# EAGLE design memoryboard31 (EAGLE 7.3.0)
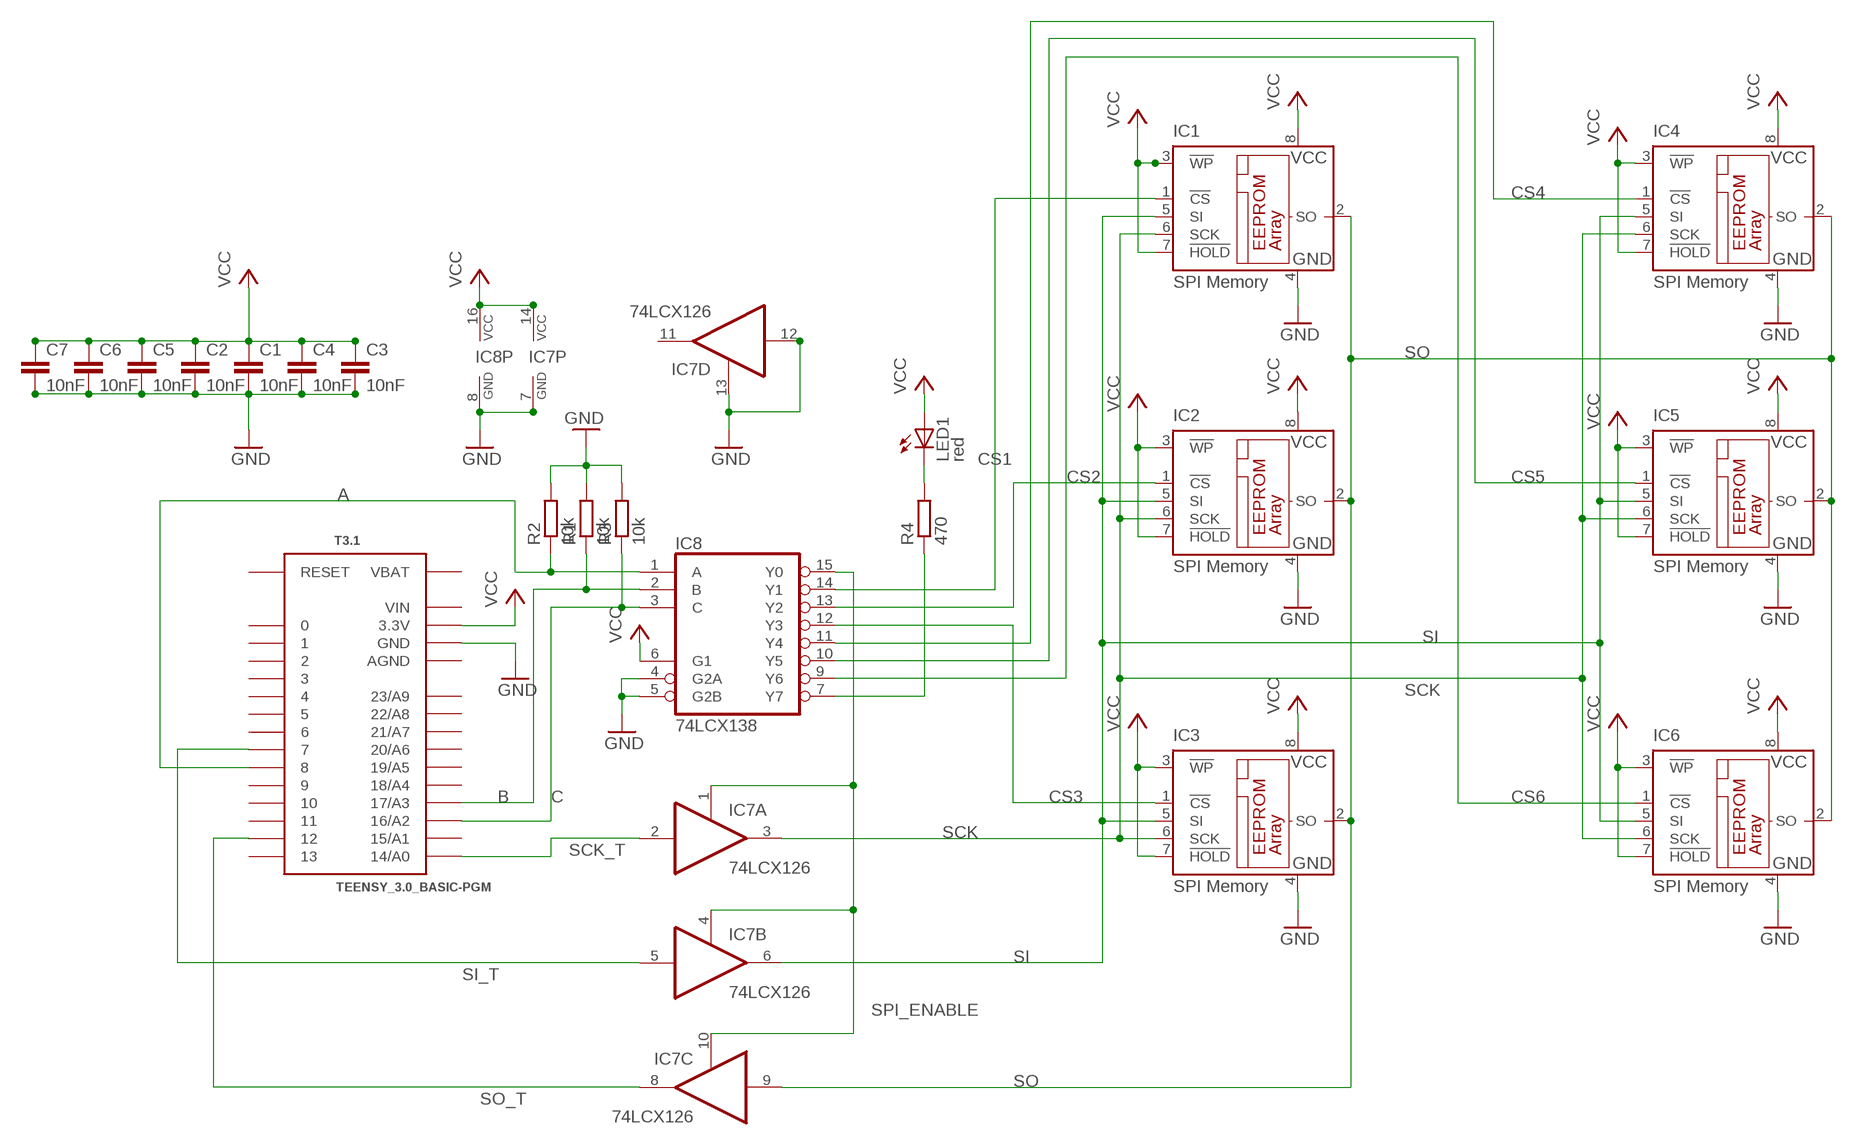
[diagram p0: schematic, sheet 1]

## Parts
C1  10nF  C-EUC0603  [C0603]
C2  10nF  C-EUC0603  [C0603]
C3  10nF  C-EUC0603  [C0603]
C4  10nF  C-EUC0603  [C0603]
C5  10nF  C-EUC0603  [C0603]
C6  10nF  C-EUC0603  [C0603]
C7  10nF  C-EUC0603  [C0603]
IC1  SPI Memory  25C080SN  [SO-08]
IC2  SPI Memory  25C080SN  [SO-08]
IC3  SPI Memory  25C080SN  [SO-08]
IC4  SPI Memory  25C080SN  [SO-08]
IC5  SPI Memory  25C080SN  [SO-08]
IC6  SPI Memory  25C080SN  [SO-08]
IC7  74LCX126  74AC126D  [SO14]
IC8  74LCX138  74HC138D  [SO16]
LED1  red  LEDSML0603  [SML0603]
R1  10k  R-EU_R0603  [R0603]
R2  10k  R-EU_R0603  [R0603]
R3  10k  R-EU_R0603  [R0603]
R4  470  R-EU_R0603  [R0603]
T3.1  TEENSY_3.0_BASIC-PGM  [TEENSY_3.0_BASIC-PGM]

## Nets
A: IC8.1(A) R2.1 T3.1.8
B: IC8.2(B) R1.1 T3.1.17/A3
C: IC8.3(C) R3.1 T3.1.16/A2
CS1: IC1.1(!CS) IC8.14(Y1)
CS2: IC2.1(!CS) IC8.13(Y2)
CS3: IC3.1(!CS) IC8.12(Y3)
CS4: IC4.1(!CS) IC8.11(Y4)
CS5: IC5.1(!CS) IC8.10(Y5)
CS6: IC6.1(!CS) IC8.9(Y6)
GND: C1.2 C2.2 C3.2 C4.2 C5.2 C6.2 C7.2 IC1.4(GND) IC2.4(GND) IC3.4(GND) IC4.4(GND) IC5.4(GND) IC6.4(GND) IC7.7(P:GND) IC7.12(D:I) IC7.13(D:OE) IC8.4(G2A) IC8.5(G2B) IC8.8(GND) R1.2 R2.2 R3.2 T3.1.GND T3.1.GND1(GND)
N$1: IC8.7(Y7) R4.1
N$2: LED1.C R4.2
SCK: IC1.6(SCK) IC2.6(SCK) IC3.6(SCK) IC4.6(SCK) IC5.6(SCK) IC6.6(SCK) IC7.3(A:O)
SCK_T: IC7.2(A:I) T3.1.14/A0
SI: IC1.5(SI) IC2.5(SI) IC3.5(SI) IC4.5(SI) IC5.5(SI) IC6.5(SI) IC7.6(B:O)
SI_T: IC7.5(B:I) T3.1.7
SO: IC1.2(SO) IC2.2(SO) IC3.2(SO) IC4.2(SO) IC5.2(SO) IC6.2(SO) IC7.9(C:I)
SO_T: IC7.8(C:O) T3.1.12
SPI_ENABLE: IC7.1(A:OE) IC7.4(B:OE) IC7.10(C:OE) IC8.15(Y0)
VCC: C1.1 C2.1 C3.1 C4.1 C5.1 C6.1 C7.1 IC1.3(!WP) IC1.7(!HOLD) IC1.8(VCC) IC2.3(!WP) IC2.7(!HOLD) IC2.8(VCC) IC3.3(!WP) IC3.7(!HOLD) IC3.8(VCC) IC4.3(!WP) IC4.7(!HOLD) IC4.8(VCC) IC5.3(!WP) IC5.7(!HOLD) IC5.8(VCC) IC6.3(!WP) IC6.7(!HOLD) IC6.8(VCC) IC7.14(P:VCC) IC8.6(G1) IC8.16(VCC) LED1.A T3.1.3.3V T3.1.3.3V1(3.3V)
Unconnected: IC7.11(D:O) T3.1.0 T3.1.1 T3.1.2 T3.1.3 T3.1.4 T3.1.5 T3.1.6 T3.1.9 T3.1.10 T3.1.11 T3.1.13 T3.1.15/A1 T3.1.18/A4 T3.1.19/A5 T3.1.20/A6 T3.1.21/A7 T3.1.22/A8 T3.1.23/A9 T3.1.RESET

## Power pins joined to a net without a drawn wire
AGND: T3.1.AGND
VBAT: T3.1.VBAT
VIN: T3.1.VIN

## Library data of the parts
C1-C7 = resistor:C-EU: CAPACITOR, European symbol
IC1-IC6 = microchip:25*: Serial EEPROM 4K/ 8K , SPI bus; MF: MICROCHIP; MPN: 25C080/SN; OC_FARNELL: unknown; OC_NEWARK: 96K4086
IC7 = 74xx-eu:74*126: Quad bus BUFFER, 3-state
IC8 = 74xx-eu:74*138: 3-line to 8-line DECODER/DEMULTIPLEXER
LED1 = led:LED: LED OSRAM: - CHIPLED LG R971, LG N971, LY N971, LG Q971, LY Q971, LO R971, LY R971 LH N974, LH R974 LS Q976, LO Q976, LY Q976 LO Q996 - Hyper CHIPLED LW Q18S LB Q993, LB Q99A, LB R99A - SideLED LS A670, LO A670, LY A670, LG A670, LP A670 LB A673, LV A673, LT A673, LW A673 LH A674 LY A675 LS A676, LA A676, LO A676, LY A676, LW A676 LS A679, LY A679, LG A679 - Hyper Micro SIDELED® LS Y876, LA Y876, LO Y876, LY Y876 LT Y87S - SmartLED LW L88C, LW L88S LB L89C, LB L89S, LG L890 LS L89K, LO L89K, LY L89K LS L896, LA L896, LO L896, LY L896 - TOPLED LS T670, LO T670, LY T670, LG T670, LP T670 LSG T670, LSP T670, LSY T670, LOP T670, LYG T670 LG T671, LOG T671, LSG T671 LB T673, LV T673, LT T673, LW T673 LH T674 LS T676, LA T676, LO T676, LY T676, LB T676, LH T676, LSB T676, LW T676 LB T67C, LV T67C, LT T67C, LS T67K, LO T67K, LY T67K, LW E67C LS E67B, LA E67B, LO E67B, LY E67B, LB E67C, LV E67C, LT E67C LW T67C LS T679, LY T679, LG T679 LS T770, LO T770, LY T770, LG T770, LP T770 LB T773, LV T773, LT T773, LW T773 LH T774 LS E675, LA E675, LY E675, LS T675 LS T776, LA T776, LO T776, LY T776, LB T776 LHGB T686 LT T68C, LB T68C - Hyper Mini TOPLED® LB M676 - Mini TOPLED Santana® LG M470 LS M47K, LO M47K, LY M47K Source: http://www.osram.convergy.de LUXEON: - LUMILED® LXK2-PW12-R00, LXK2-PW12-S00, LXK2-PW14-U00, LXK2-PW14-V00 LXK2-PM12-R00, LXK2-PM12-S00, LXK2-PM14-U00 LXK2-PE12-Q00, LXK2-PE12-R00, LXK2-PE12-S00, LXK2-PE14-T00, LXK2-PE14-U00 LXK2-PB12-K00, LXK2-PB12-L00, LXK2-PB12-M00, LXK2-PB14-N00, LXK2-PB14-P00, LXK2-PB14-Q00 LXK2-PR12-L00, LXK2-PR12-M00, LXK2-PR14-Q00, LXK2-PR14-R00 LXK2-PD12-Q00, LXK2-PD12-R00, LXK2-PD12-S00 LXK2-PH12-R00, LXK2-PH12-S00 LXK2-PL12-P00, LXK2-PL12-Q00, LXK2-PL12-R00 Source: www.luxeon.com KINGBRIGHT: KA-3528ASYC Source: www.kingbright.com
R1-R4 = resistor:R-EU_: RESISTOR, European symbol
T3.1 = Teensy3.0:TEENSY_3.0_BASIC-PGM: Teensy 3.0 Board outline identical to other 'basic' version except that 'PGM' pin has been omitted. See '+4', 'AllAnalogPins", and 'AllPins' packages for additional pin holes, as needed.

## Net classes
0 default: clearance 0.205 mm

## Board
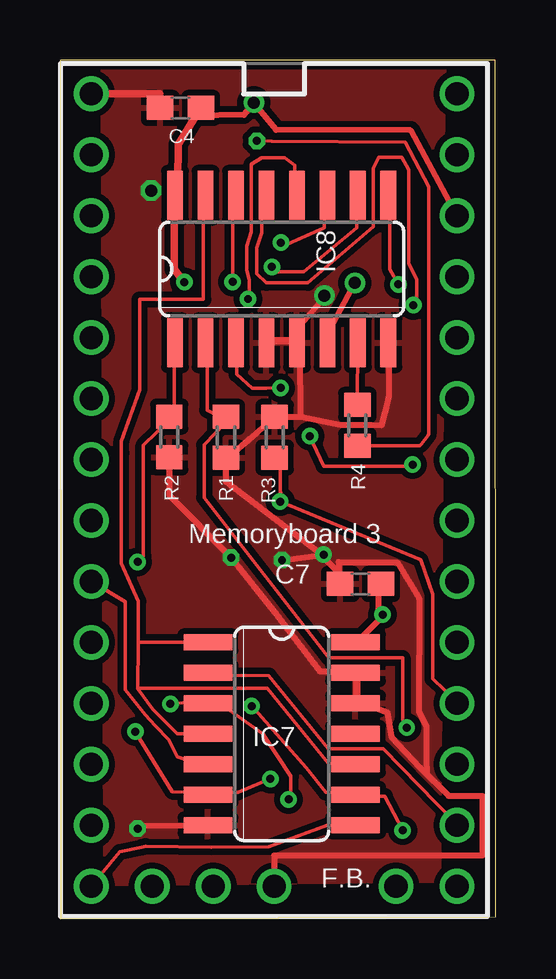
[diagram p1: board, top side]
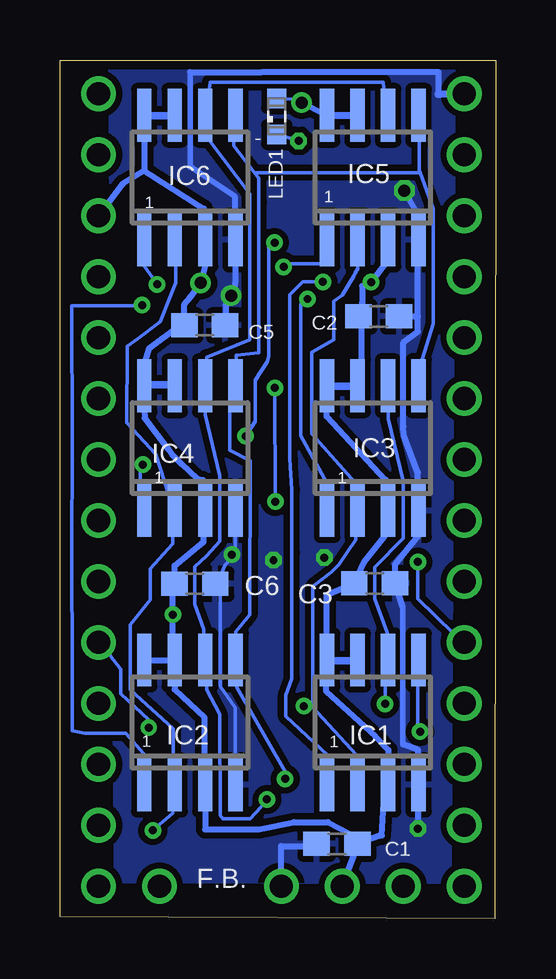
[diagram p2: board, bottom side, seen from below]

Size 18.15 x 35.77 mm. Coordinates in mm from the lower left corner, seen from the top.
Outline: 0.03,0 18.15,0.08 18.13,35.77 0,35.77 0.03,0
Copper layers (1*16): Top 0.0356mm / dielectric 1.5011mm / Bottom 0.0356mm
Design rules "LaenPCBOrder *": minimum track width 6mil, minimum drill 13mil, track to track 6mil, track to pad 6mil, pad to pad 6mil, via to via 6mil, smd to smd 6mil, copper to edge 15mil, drill to drill 6mil, minimum pad ring 7mil, minimum via ring 7mil, stop-mask expansion 3mil, vias tented up to drill 25mil, thermal gap 10mil

### Footprints (pad centres in the part's own frame; a part is rotated, then mirrored left to right if it is on the bottom)
C0603 = smd 1.1 x 1: 1 -0.85,0; 2 0.85,0
SO-08 = smd 0.6 x 2.2: 1 -1.905,-2.6; 2 -0.635,-2.6; 3 0.635,-2.6; 4 1.905,-2.6; 5 1.905,2.6; 6 0.635,2.6; 7 -0.635,2.6; 8 -1.905,2.6
SO14 = smd 0.66 x 2.032: 1 -3.81,-3.073; 2 -2.54,-3.073; 3 -1.27,-3.073; 4 0,-3.073; 5 1.27,-3.073; 6 2.54,-3.073; 7 3.81,-3.073; 8 3.81,3.073; 9 2.54,3.073; 10 1.27,3.073; 11 0,3.073; 12 -1.27,3.073; 13 -2.54,3.073; 14 -3.81,3.073
SO16 = smd 0.66 x 2.032: 1 -4.445,-3.073; 2 -3.175,-3.073; 3 -1.905,-3.073; 4 -0.635,-3.073; 5 0.635,-3.073; 6 1.905,-3.073; 7 3.175,-3.073; 8 4.445,-3.073; 9 4.445,3.073; 10 3.175,3.073; 11 1.905,3.073; 12 0.635,3.073; 13 -0.635,3.073; 14 -1.905,3.073; 15 -3.175,3.073; 16 -4.445,3.073
SML0603 = smd 0.8 x 0.8: A 0.75,0; C -0.75,0
R0603 = smd 1 x 1.1: 1 -0.85,0; 2 0.85,0
TEENSY_3.0_BASIC-PGM = drill 0.965: 0 -7.62,13.97; 1 -7.62,11.43; 2 -7.62,8.89; 3 -7.62,6.35; 3.3V 7.62,11.43; 3.3V1 -2.54,-16.51; 4 -7.62,3.81; 5 -7.62,1.27; 6 -7.62,-1.27; 7 -7.62,-3.81; 8 -7.62,-6.35; 9 -7.62,-8.89; 10 -7.62,-11.43; 11 -7.62,-13.97; 12 -7.62,-16.51; 13 7.62,-16.51; 14/A0 7.62,-13.97; 15/A1 7.62,-11.43; 16/A2 7.62,-8.89; 17/A3 7.62,-6.35; 18/A4 7.62,-3.81; 19/A5 7.62,-1.27; 20/A6 7.62,1.27; 21/A7 7.62,3.81; 22/A8 7.62,6.35; 23/A9 7.62,8.89; AGND 7.62,13.97; GND -7.62,16.51; GND1 0,-16.51; RESET 5.08,-16.51; VBAT -5.08,-16.51; VIN 7.62,16.51

### Placement (x,y rotation side)
C1  6.6,3.11 180 bottom
C2  4.87,25.09 0 bottom
C3  5.03,13.96 0 bottom
C4  5.02,33.78 180 top
C5  12.12,24.72 0 bottom
C6  12.53,13.94 0 bottom
C7  12.52,13.94 180 top
IC1  5.11,8.17 0 bottom
IC2  12.73,8.17 0 bottom
IC3  5.11,19.6 0 bottom
IC4  12.73,19.6 0 bottom
IC5  5.11,30.87 0 bottom
IC6  12.73,30.87 0 bottom
IC7  9.24,7.7 270 top
IC8  9.24,27.06 0 top
LED1  9.11,33.42 90 bottom
R1  6.92,20.05 270 top
R2  4.55,20.06 270 top
R3  8.94,20.05 90 top
R4  12.39,20.56 270 top
T3.1  8.92,17.86 0 top

### Tracks (layer width: path | path; a pad name or v marks a point on that pad's centre or on a via)
A  (via drill 0.33)
  Top 0.152: IC8.1 4.75,23.85 4.75,20.96 R2.1 4.6,20.8 3.47,19.72 3.47,15.1 v3.23,14.86
  Bottom 0.152: v3.23,14.86 3.23,13.34 1.74,11.87 1.4,11.51 T3.1.8
B  (via drill 0.33)
  Top 0.152: IC8.2 6.13,23.85 6.13,21.18 6.89,20.8 R1.1 6.89,20.65 6,19.74 6,17.54 11.2,10.87 14.28,10.87 14.28,8.29 v14.45,7.96
  Bottom 0.152: v14.45,7.96 14.45,8.29 15.61,9.36 15.61,10.38 16.49,11.51 T3.1.17/A3
C  (via drill 0.33)
  Top 0.152: T3.1.16/A2 16.49,9.07 15.53,9.98 15.53,13.51 15.03,14.95 9.19,17.37 9.16,19.11 R3.1 9.17,19.13 v9.17,17.37 | v9.19,22.11 8.6,22.1 8,22.1 7.36,22.68 7.35,24.46 7.35,24 IC8.3
  Bottom 0.152: v9.17,17.37 v9.19,22.11
CS1  (via drill 0.33)
  Top 0.152: v7.19,26.53 7.19,30.1 IC8.14
  Bottom 0.152: v7.19,26.53 8.03,26.53 8.56,25.98 8.56,25.3 8.56,22.78 8.56,19.16 8.49,17.88 8.49,17.83 8.49,15.23 8.49,13.7 8.49,10 8.73,9.31 8.73,8.43 7,6.81 6.98,5.73 IC1.1
CS2  (via drill 0.33)
  Top 0.152: v14.72,25.56 14.86,25.59 14.86,26.62 14.54,27.3 14.54,31.2 14.23,31.71 13.72,31.71 13.27,31.71 13.06,31.27 13.06,28.82 10.33,26.49 8.6,26.49 8.2,26.87 8.2,27.95 8.41,28.58 8.41,29.66 8.56,30.1 IC8.13
  Bottom 0.152: v14.72,25.56 14.8,25.62 14.77,25.53 15.3,25.53 15.45,25.53 17.65,25.53 17.63,19.87 17.65,15.06 17.66,13.26 17.63,12.28 17.63,11.83 17.63,7.83 17.11,7.71 15.41,7.71 14.66,6.86 14.66,5.72 IC2.1
CS3  (via drill 0.33)
  Top 0.152: 7.77,25.82 v7.83,25.82 7.89,25.82 7.89,26.62 7.77,27.02 7.77,28.01 7.97,28.62 7.97,31.43 8.41,31.7 9.37,31.7 9.78,31.39 9.78,30.25 IC8.12
  Bottom 0.152: v7.83,25.82 8.12,25.6 8.12,20.12 7.03,18.15 7.03,17.89 IC3.1
CS4  (via drill 0.33)
  Top 0.152: v9.2,28.16 9.46,28.09 11.02,28.79 11,30.1 IC8.11 | v10.41,20.1 10.99,18.85 14.49,18.85 14.55,18.68 v14.69,18.91
  Bottom 0.152: v9.2,28.16 9.45,28.09 9.45,23.42 9.51,23.21 10.01,22.43 10.01,20.73 v10.41,20.1 | v14.69,18.91 14.8,18.81 14.8,17.79 IC4.1
CS5  (via drill 0.33)
  Top 0.152: v8.82,27.16 8.99,26.96 10.17,26.96 12.37,28.79 12.37,30.1 IC8.10
  Bottom 0.152: v8.82,27.16 8.63,27.28 7.04,27.28 IC5.1
CS6  (via drill 0.33)
  Top 0.152: v14.1,26.43 13.75,27.05 13.75,30.1 IC8.9
  Bottom 0.152: v14.1,26.43 14.72,27.3 14.51,28.27 IC6.1
GND  (via drill 0.33, 0.5)
  Top 0.152: 1.4,34.37 T3.1.GND | 12.22,10.29 IC7.13 12.37,10.13 | 12.37,9.07 IC7.12 12.37,8.92 12.83,8.92 | 7.04,19.23 R1.2 | 11.61,14.4 11.61,14.86 | 11.61,13.64 C7.2 | 8.58,24.08 IC8.4 | 9.17,20.96 R3.2 9.31,20.91 | 10.01,23.61 IC8.5 9.33,24.03 9.71,24.08 9.89,24.52 9.94,24.61 | 13.73,23.76 13.59,23.85 IC8.8 | 11.05,25.92 v11.02,25.95 | 10.7,15.32 v10.99,15.16 | 15.28,6.11 14.99,6.3
  Top 0.229: 9.94,24.61 11.05,25.92
  Top 0.254: v3.23,3.75 3.32,3.87 IC7.7 | 12.22,10.29 10.85,10.29 8.95,12.77 v7.13,15.04 4.56,17.65 R2.2 | 12.83,8.92 13.64,8.6 13.81,7.57 14.99,6.3 16.2,5.11 17.59,5.11 17.6,4.39 17.6,3.08 17.6,2.62 15.12,2.62 14.42,2.62 14.39,2.62 13.27,2.62 12.41,2.62 9.01,2.62 8.92,2.62 T3.1.GND1 | 7.04,19.23 7.97,20.04 8.47,20.48 R3.2 | 11.61,13.64 11.61,14.86 14.05,14.84 14.97,13.34 14.95,8.65 15.27,8.01 15.27,6.59 15.28,6.11 | 11.61,14.4 10.7,15.32 6.92,18.2 R1.2 | 10.01,23.61 10.03,20.9 10.04,20.91 | 9.31,20.91 10.04,20.91 | 13.73,23.76 13.72,22.78 13.72,21.79 13.61,21.34 13.41,20.56 12.97,20.57 11.7,20.57 10.04,20.91 | v9.25,14.94 v10.99,15.16
  Top 0.305: 12.37,10.13 12.37,9.07 | 9.94,23.1 9.91,23.84 9.77,24.08 9.71,24.08 8.58,24.08 | 1.4,34.37 4.15,34.37 C4.2
  Bottom 0.152: 3.23,15.93 3.23,16.99 IC3.4 3.23,17.15 | 4.19,14.08 C3.2 | 3.23,4.76 3.23,5.56 IC1.4 | 3.86,12.91 3.87,12.98 | 3.23,28.27 IC5.4 | 2.3,34.35 T3.1.GND | 7.18,3.02 C1.2 | 11.61,13.94 11.26,14.75 10.84,15.21 | 10.84,15.21 10.85,15.77 10.85,16.99 IC4.4 | 11.61,13.94 11.46,13.79 11.46,9.68 10.85,8.79 10.85,5.72 IC2.4 | 11.61,13.94 C6.2 | 10.85,28.27 IC6.4 10.85,28.42 | 10.84,15.21 10.84,15.33 v10.99,15.16
  Bottom 0.229: 3.86,7.25 3.86,12.91 | 12.73,31.32 12.73,35.27
  Bottom 0.254: 4.19,14.08 4.19,14.75 3.23,15.93 | v3.23,3.75 3.23,3.76 3.23,4.76 | 3.86,7.25 3.23,7.03 IC1.4 | 3.87,12.98 C3.2 | 3.23,25.09 3.23,24.46 3.84,24 3.84,20.51 3.83,20.15 3.23,18.58 3.23,17.15 | 7.18,3.02 8.93,3.02 8.93,2.8 | 8.93,2.8 8.95,1.37 T3.1.GND1 8.93,2.8 | 10.96,26.03 10.84,26.53 10.85,28.27 | 10.96,26.03 11.25,25.56 C5.2 | v11.02,25.95 10.96,26.03 | C2.2 3.23,25.09 | 3.23,25.09 3.23,28.27 | 12.73,35.27 9.74,35.27 8.92,35.27 2.38,35.27 2.38,34.35 | 12.73,31.32 10.85,30.07 10.85,28.42 | v3.79,30.33 3.23,29.32 3.23,28.27
  Bottom 0.305: 2.3,34.35 2.33,34.37 | 2.38,34.35 T3.1.GND
  Bottom 0.406: 3.23,28.27 IC5.4
  pour Bottom (isolate 0.254): 1.72,35.43 16.06,35.42 15.85,1.52 1.92,1.49 1.89,2.41
  pour Top (isolate 0.254): 1.75,35.43 16.03,35.43 16.03,34.85 15.99,34.85 15.82,1.55 1.9,1.42 1.87,2.06
N$1
  Top 0.152: R4.1 IC8.7
N$2  (via drill 0.33)
  Top 0.152: v8.2,32.4 8.82,32.39 14.39,32.35 15.36,30.5 15.36,20.19 15.35,20.15 15.06,19.77 14.98,19.71 R4.2
  Bottom 0.152: v8.2,32.4 LED1.C
SCK  (via drill 0.33)
  Top 0.152: v4.6,8.95 6.13,9.07 IC7.3 6.28,8.92 6.74,8.92 8.46,7.7 9.62,5.93 9.62,5.27 v9.53,4.97
  Bottom 0.152: v4.6,8.95 4.6,10.74 IC1.6 4.51,11.9 5.03,13.32 5.03,14.63 3.84,15.85 3.84,18.21 4.47,20.83 4.45,22.17 IC3.6 | IC5.6 | v9.53,4.97 9.78,4.63 10.21,4.16 11.37,4.16 11.48,4.3 11.49,8.52 12.04,9.53 12.07,10.74 IC2.6 12.16,10.93 12.16,12.06 12.53,13.09 12.53,14.66 12.04,15.12 11.49,15.73 11.49,18.44 12.09,20.99 12.07,22.17 IC4.6 12.07,22.33 12.04,23.39 10.24,24.13 10.24,30.21 11.87,32.34 12.07,33.45 IC6.6 12.07,33.6 11.89,34.85 9.89,34.85 4.68,34.85 4.56,33.47
  Bottom 0.406: IC5.6 4.56,33.47
SCK_T
  Top 0.152: IC7.2 6.28,10.13 8.7,10.12 11.19,7.07 13.47,7.07 16.44,4.02 T3.1.14/A0
SI  (via drill 0.33)
  Top 0.152: v3.14,7.79 4.68,5.29 5.18,5.26 5.52,5.26 6.13,5.26 IC7.6 6.28,5.26 7.42,5.26 v8.76,5.82
  Bottom 0.152: 3.14,31.07 3.17,31.18 3.17,32.51 3.08,33.45 IC5.5 | 3.14,31.07 2.59,29.57 2.59,24.78 3.05,23.3 3.08,22.33 IC3.5 | 9.86,30.85 10.9,32.2 10.93,33.35 IC6.5 | 3.15,31.09 3.14,31.07 | 3.14,31.07 4.69,31.07 10.03,31.07 9.86,30.85 | v3.14,7.79 3.25,8.09 3.23,10.74 IC1.5 | v8.76,5.82 8.76,6.13 10.77,9.63 10.77,10.79 IC2.5 10.82,11.95 10.24,12.65 10.23,19.08 11.06,19.52 11.06,21.17 10.85,22.17 IC4.5 10.81,23.47 9.86,23.58 9.86,29.84 9.86,30.85
SI_T
  Top 0.152: T3.1.7 2.73,13.2 2.73,9.53 3.55,8.49 3.98,8.03 4.53,7.45 4.89,6.74 5.67,6.48 6.13,6.48 IC7.5
SO  (via drill 0.33)
  Top 0.152: v14.28,3.67 13.53,5.11 12.37,5.11 IC7.9 12.22,5.26 11.06,5.26 10.26,6.28 8.11,8.72 v7.99,8.85
  Bottom 0.152: 7.65,8.85 7.62,8.85 7.6,13.18 7.6,13.81 7.56,13.88 6.84,14.43 6.52,14.75 5.82,15.79 5.82,16.99 IC3.2 5.82,17.15 5.84,18.15 7.67,20.21 7.67,23.59 6.74,24.13 6.74,24.63 6.74,24.92 6.74,25.73 6.39,25.97 6.07,26.49 5.91,26.76 5.84,26.9 5.73,27.08 5.67,28.27 IC5.2 | 7.65,8.85 5.78,6.81 5.82,5.72 IC1.2 | v14.28,3.67 13.44,4.39 13.43,4.51 13.43,4.63 13.44,5.56 IC2.2 13.44,5.72 13.43,7.91 15.22,9.54 15.22,12.24 14.39,13.27 14.39,14.58 13.44,15.62 13.44,16.99 IC4.2 13.44,17.15 14.16,19.36 15.36,20.67 15.35,23.85 14.9,24.16 13.96,24.87 13.56,25.88 13.32,26.5 13.32,28.21 IC6.2 | v7.99,8.85 7.65,8.85
SO_T
  Top 0.152: IC7.8 11.14,3.89 8.7,2.99 6.29,2.97 3.57,3.02 3.4,2.97 2.48,2.77 T3.1.12
SPI_ENABLE
  Top 0.152: IC7.4 4.88,7.7 3.86,8.72 3.25,9.57 | 3.26,11.52 3.25,9.57 | 3.26,11.52 | 3.25,9.57 3.29,9.6 8.63,9.6 11.19,6.48 12.22,6.48 IC7.10 | 3.26,11.52 5.67,11.51 IC7.1 6.13,11.51 | 3.26,11.52 3.26,13.21 2.56,14.8 2.56,19.4 2.56,19.89 3.32,22.04 3.32,25.8 5.97,25.8 5.97,30.1 IC8.15
VCC  (via drill 0.33, 0.5)
  Top 0.152: 4.91,30.71 4.91,30.25 IC8.16 4.75,30.1 | 13.29,13.49 C7.1 | 12.37,11.51 IC7.14 | v13.44,12.66 13.29,12.42 | 11.38,24.83 11.16,24 IC8.6
  Top 0.254: 13.29,13.49 13.29,12.42 12.37,11.51 | v12.28,26.49 11.38,24.83 | v8.08,34 8.06,34.03 | T3.1.3.3V 16.5,29.32 14.61,32.84 9.01,32.86 v8.08,34 | v8.08,34 7.79,33.63 7.67,33.48 5.56,33.45
  Top 0.305: 4.91,30.71 4.92,32.26 5.12,32.56 C4.1 | 4.75,30.1 4.75,27.05 v5.18,26.52
  Bottom 0.152: 5.82,22.17 IC3.7 | 6.89,22.17 IC3.8 | 4.47,27.45 4.45,28.27 IC5.3 | 5.59,23.21 5.67,22.33 IC3.7 | 5.59,25.02 C2.1 | 5.91,2.61 5.68,3.08 C1.1 6.05,3.35 5.68,3.32 | 4.83,3.44 4.74,3.46 | 4.62,5.49 IC1.3 4.6,5.72 | 7.03,10.81 IC1.7 | 4.63,15.91 4.6,16.99 IC3.3 4.6,17.15 | 6.89,10.74 IC1.8 | 5.82,10.74 IC1.7 | 7.07,10.81 IC1.7 | 7.04,22.13 IC3.7 | 12.22,5.56 IC2.3 12.13,5.73 | 13.44,13.94 C6.1 C7.1 | 13.44,10.9 IC2.7 | 12.09,17.15 IC4.3 12.22,17.15 12.12,17.59 | 14.51,10.74 IC2.8 | 13.44,10.74 IC2.7 | 13.4,10.87 IC2.7 | 12.95,24.7 C5.1 | 14.65,22.43 IC4.8 | 13.44,22.33 IC4.7 13.29,22.17 13.29,22.24 | 12.1,27.23 IC6.3 12.15,28.42 | 5.82,33.45 IC5.7 | 6.89,33.45 IC5.8 | 13.44,33.45 IC6.7 | 14.51,33.45 IC6.8 14.66,33.45 14.65,32.46 | 16.49,29.34 T3.1.3.3V | LED1.A 8.14,34.13 8.09,34 v8.08,34
  Bottom 0.254: 4.47,27.45 v5.18,26.52 5.56,26.35 5.56,25.66 | 5.56,25.66 | 5.56,25.66 C2.1 | 5.59,25.02 5.59,23.21 | T3.1.3.3V1 5.91,2.61 | 4.74,3.46 4.62,5.49 | 4.83,3.44 C1.1 | 7.03,10.81 7.03,13.49 C3.1 5.47,14.86 4.63,15.91 | 4.47,6.64 4.47,7.03 5,7.57 7.07,9.48 7.07,10.81 | 7.04,22.13 7.04,20.91 4.6,18.27 | 12.22,5.56 12.09,4.59 12.1,3.72 9.85,3.72 8.4,4.02 6.98,4.02 5.68,3.32 | 13.44,10.9 v13.44,12.66 13.44,13.94 | 12.09,17.15 12.16,15.7 13.37,14.71 C7.1 | 13.44,10.74 14.51,10.74 | 12.13,5.73 12.13,8.38 13.37,9.54 13.4,10.87 | 13.11,24.75 14.43,23.76 14.66,23 14.68,22.33 14.68,22.25 | 12.1,27.23 v12.28,26.49 12.73,25.89 12.98,25.57 C5.1 | 16.49,29.34 15.53,30.62 14.65,31.17 | 14.65,32.46 14.65,31.17 | 12.15,28.42 12.15,29.58 14.65,31.17 | 12.19,17.63 12.19,18.27 12.44,18.32 13.09,18.94 13.49,19.34 13.63,19.56 14.62,20.85 14.69,22.25 14.68,22.25 | IC5.7 7.1,33.48 v8.08,34 | 6.89,33.45 5.75,33.45 | IC4.8 14.64,22.25 14.68,22.25
  Bottom 0.305: 6.89,22.17 5.82,22.17 | 5.82,10.74 6.89,10.74 | 4.6,5.72 4.54,6.1 4.54,6.2 4.47,6.64 | 4.6,17.15 4.6,18.27 | 13.11,24.75 12.95,24.7 | 14.51,33.45 13.44,33.45 | 13.29,22.24 14.69,22.25 | 12.19,17.63 12.16,17.6 12.12,17.59
  Bottom 0.406: 5.75,33.45 IC5.7

### Text on the board
tPlace: Memoryboard 3 | F.B.
bPlace: - | 1 | 1 | 1 | 1 | 1 | 1 | F.B.